# EAGLE design discretefpga (EAGLE 7.7.0)
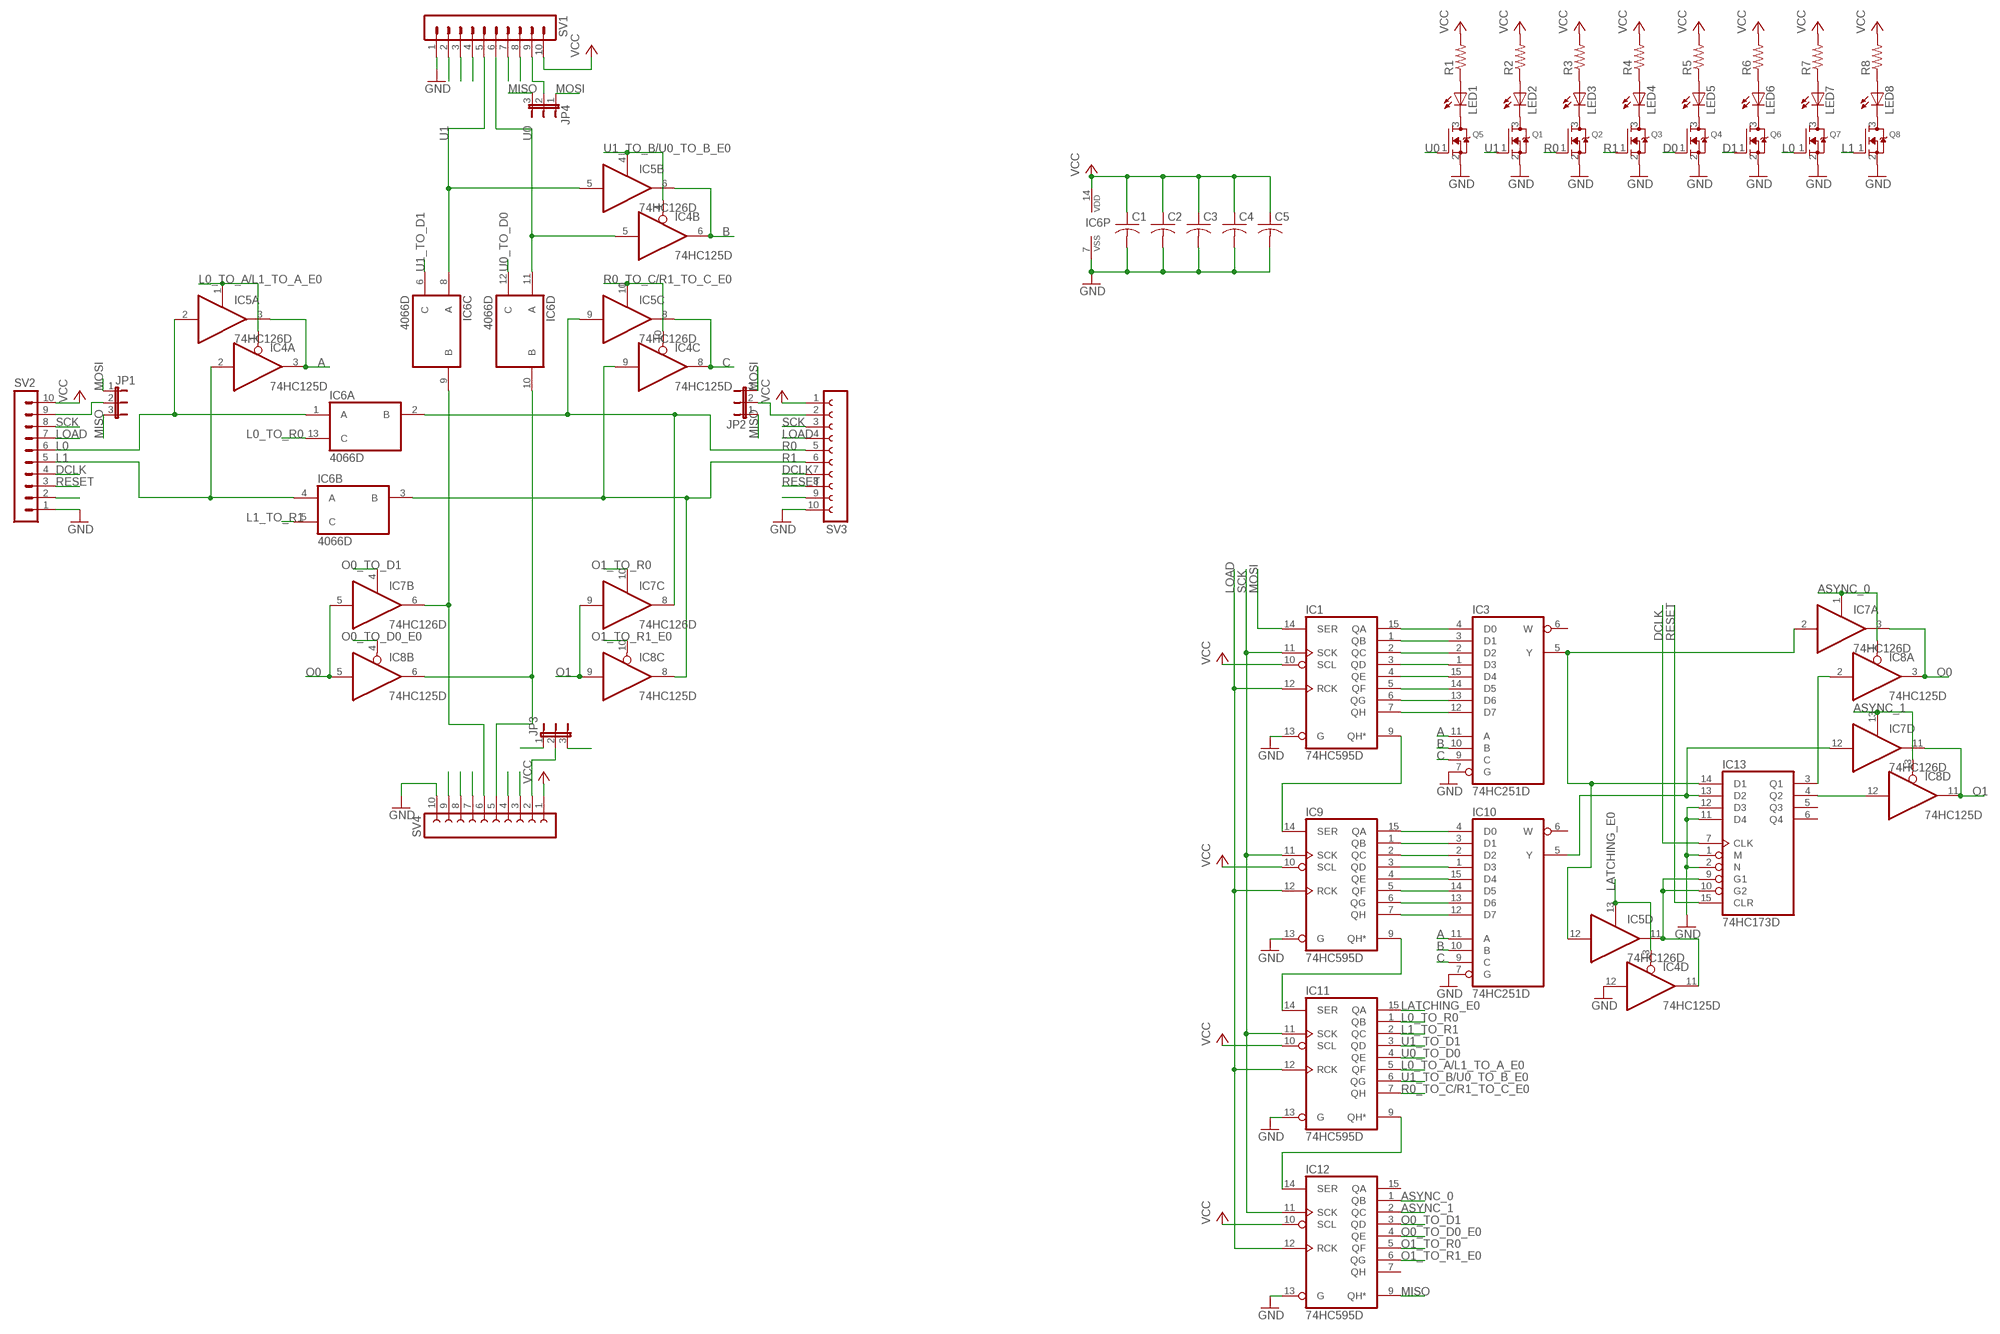
[diagram p0: schematic, sheet 1]

## Parts
C1  C-USC0805  [C0805]
C2  C-USC0805  [C0805]
C3  C-USC0805  [C0805]
C4  C-USC0805  [C0805]
C5  C-USC0805  [C0805]
IC1  74HC595D  [SO16]
IC3  74HC251D  [SO16]
IC4  74HC125D  [SO14]
IC5  74HC126D  [SO14]
IC6  4066D  [SO14]
IC7  74HC126D  [SO14]
IC8  74HC125D  [SO14]
IC9  74HC595D  [SO16]
IC10  74HC251D  [SO16]
IC11  74HC595D  [SO16]
IC12  74HC595D  [SO16]
IC13  74HC173D  [SO16]
JP1  JP2E  [JP2]
JP2  JP2E  [JP2]
JP3  JP2E  [JP2]
JP4  JP2E  [JP2]
LED1  LEDCHIP-LED0805  [CHIP-LED0805]
LED2  LEDCHIP-LED0805  [CHIP-LED0805]
LED3  LEDCHIP-LED0805  [CHIP-LED0805]
LED4  LEDCHIP-LED0805  [CHIP-LED0805]
LED5  LEDCHIP-LED0805  [CHIP-LED0805]
LED6  LEDCHIP-LED0805  [CHIP-LED0805]
LED7  LEDCHIP-LED0805  [CHIP-LED0805]
LED8  LEDCHIP-LED0805  [CHIP-LED0805]
Q1  MOSFET-NREFLOW  [SOT23]
Q2  MOSFET-NREFLOW  [SOT23]
Q3  MOSFET-NREFLOW  [SOT23]
Q4  MOSFET-NREFLOW  [SOT23]
Q5  MOSFET-NREFLOW  [SOT23]
Q6  MOSFET-NREFLOW  [SOT23]
Q7  MOSFET-NREFLOW  [SOT23]
Q8  MOSFET-NREFLOW  [SOT23]
R1  R-US_R0805  [R0805]
R2  R-US_R0805  [R0805]
R3  R-US_R0805  [R0805]
R4  R-US_R0805  [R0805]
R5  R-US_R0805  [R0805]
R6  R-US_R0805  [R0805]
R7  R-US_R0805  [R0805]
R8  R-US_R0805  [R0805]
SV1  MA10-1W  [MA10-1W]
SV2  MA10-1W  [MA10-1W]
SV3  FE10W  [FE10W]
SV4  FE10W  [FE10W]

## Nets
A: IC3.11(A) IC4.3(A:O) IC5.3(A:O) IC10.11(A)
ASYNC_0: IC7.1(A:OE) IC8.1(A:OE) IC12.1(QB)
ASYNC_1: IC7.13(D:OE) IC8.13(D:OE) IC12.2(QC)
B: IC3.10(B) IC4.6(B:O) IC5.6(B:O) IC10.10(B)
C: IC3.9(C) IC4.8(C:O) IC5.8(C:O) IC10.9(C)
D0: IC6.10(D:B) IC8.6(B:O) Q4.1(G) SV4.5
D1: IC6.9(C:B) IC7.6(B:O) Q6.1(G) SV4.6
DCLK: IC13.7(CLK) SV1.4 SV2.4 SV3.7 SV4.7
GND: C1.2 C2.2 C3.2 C4.2 C5.2 IC1.13(G) IC3.7(G) IC4.12(D:I) IC6.7(P:VSS) IC9.13(G) IC10.7(G) IC11.13(G) IC12.13(G) IC13.1(M) IC13.2(N) IC13.11(D4) IC13.12(D3) Q1.2(S) Q2.2(S) Q3.2(S) Q4.2(S) Q5.2(S) Q6.2(S) Q7.2(S) Q8.2(S) SV1.1 SV2.1 SV3.10 SV4.10
L0: IC5.2(A:I) IC6.1(A:A) Q7.1(G) SV2.6
L0_TO_A/L1_TO_A_E0: IC4.1(A:OE) IC5.1(A:OE) IC11.5(QF)
L0_TO_R0: IC6.13(A:C) IC11.1(QB)
L1: IC4.2(A:I) IC6.4(B:A) Q8.1(G) SV2.5
L1_TO_R1: IC6.5(B:C) IC11.2(QC)
LATCHING_E0: IC4.13(D:OE) IC5.13(D:OE) IC11.15(QA)
LOAD: IC1.12(RCK) IC9.12(RCK) IC11.12(RCK) IC12.12(RCK) SV1.7 SV2.7 SV3.4 SV4.4
MISO: IC12.9(QH*) JP1.3 JP2.1 JP3.1 JP4.3
MOSI: IC1.14(SER) JP1.1 JP2.3 JP3.3 JP4.1
N$1: IC1.15(QA) IC3.4(D0)
N$2: IC1.1(QB) IC3.3(D1)
N$3: IC1.2(QC) IC3.2(D2)
N$4: IC1.4(QE) IC3.15(D4)
N$5: IC1.5(QF) IC3.14(D5)
N$6: IC1.6(QG) IC3.13(D6)
N$7: IC1.7(QH) IC3.12(D7)
N$8: IC3.5(Y) IC5.12(D:I) IC7.2(A:I) IC13.14(D1)
N$9: IC9.15(QA) IC10.4(D0)
N$10: IC4.11(D:O) IC5.11(D:O) IC13.9(G1) IC13.10(G2)
N$11: IC9.1(QB) IC10.3(D1)
N$12: IC9.2(QC) IC10.2(D2)
N$13: IC9.4(QE) IC10.15(D4)
N$14: IC9.5(QF) IC10.14(D5)
N$15: IC9.6(QG) IC10.13(D6)
N$16: IC9.7(QH) IC10.12(D7)
N$17: IC7.12(D:I) IC10.5(Y) IC13.13(D2)
N$18: IC1.9(QH*) IC9.14(SER)
N$19: IC8.2(A:I) IC13.3(Q1)
N$20: IC9.9(QH*) IC11.14(SER)
N$21: IC11.9(QH*) IC12.14(SER)
N$22: JP1.2 SV2.9
N$23: JP2.2 SV3.2
N$25: LED1.A R1.1
N$26: LED1.C Q5.3(D)
N$27: SV1.2
N$28: IC8.12(D:I) IC13.4(Q2)
N$29: IC9.3(QD) IC10.1(D3)
N$30: IC1.3(QD) IC3.1(D3)
N$31: SV2.2
N$34: SV3.9
N$38: SV4.9
N$40: LED2.C Q1.3(D)
N$42: LED2.A R2.1
N$43: LED3.A R3.1
N$44: LED4.A R4.1
N$45: LED5.A R5.1
N$46: LED6.A R6.1
N$47: LED7.A R7.1
N$48: LED8.A R8.1
N$49: LED3.C Q2.3(D)
N$50: LED4.C Q3.3(D)
N$51: LED5.C Q4.3(D)
N$52: JP3.2 SV4.2
N$53: LED6.C Q6.3(D)
N$54: JP4.2 SV1.9
N$55: LED7.C Q7.3(D)
N$56: LED8.C Q8.3(D)
O0: IC7.3(A:O) IC7.5(B:I) IC8.3(A:O) IC8.5(B:I)
O0_TO_D0_E0: IC8.4(B:OE) IC12.4(QE)
O0_TO_D1: IC7.4(B:OE) IC12.3(QD)
O1: IC7.9(C:I) IC7.11(D:O) IC8.9(C:I) IC8.11(D:O)
O1_TO_R0: IC7.10(C:OE) IC12.5(QF)
O1_TO_R1_E0: IC8.10(C:OE) IC12.6(QG)
R0: IC5.9(C:I) IC6.2(A:B) IC7.8(C:O) Q2.1(G) SV3.5
R0_TO_C/R1_TO_C_E0: IC4.10(C:OE) IC5.10(C:OE) IC11.7(QH)
R1: IC4.9(C:I) IC6.3(B:B) IC8.8(C:O) Q3.1(G) SV3.6
RESET: IC13.15(CLR) SV1.3 SV2.3 SV3.8 SV4.8
SCK: IC1.11(SCK) IC9.11(SCK) IC11.11(SCK) IC12.11(SCK) SV1.8 SV2.8 SV3.3 SV4.3
U0: IC4.5(B:I) IC6.11(D:A) Q5.1(G) SV1.6
U0_TO_D0: IC6.12(D:C) IC11.4(QE)
U1: IC5.5(B:I) IC6.8(C:A) Q1.1(G) SV1.5
U1_TO_B/U0_TO_B_E0: IC4.4(B:OE) IC5.4(B:OE) IC11.6(QG)
U1_TO_D1: IC6.6(C:C) IC11.3(QD)
VCC: C1.1 C2.1 C3.1 C4.1 C5.1 IC1.10(SCL) IC6.14(P:VDD) IC9.10(SCL) IC11.10(SCL) IC12.10(SCL) R1.2 R2.2 R3.2 R4.2 R5.2 R6.2 R7.2 R8.2 SV1.10 SV2.10 SV3.1 SV4.1
Unconnected: IC3.6(W) IC10.6(W) IC12.7(QH) IC12.15(QA) IC13.5(Q3) IC13.6(Q4)

## Power pins joined to a net without a drawn wire
GND: IC1.8(GND) IC3.8(GND) IC4.7(P:GND) IC5.7(P:GND) IC7.7(P:GND) IC8.7(P:GND) IC9.8(GND) IC10.8(GND) IC11.8(GND) IC12.8(GND) IC13.8(GND)
VCC: IC1.16(VCC) IC3.16(VCC) IC4.14(P:VCC) IC5.14(P:VCC) IC7.14(P:VCC) IC8.14(P:VCC) IC9.16(VCC) IC10.16(VCC) IC11.16(VCC) IC12.16(VCC) IC13.16(VCC)

## Library data of the parts
C1-C5 = resistor:C-US: CAPACITOR, American symbol
IC1 IC9 IC11 IC12 = 74xx-eu:74*595: 8-bit SHIFT REGISTER, output latch
IC3 IC10 = 74xx-eu:74*251: 1 of 8 data SELECTOR/MULTIPLEXER, 3-state
IC4 IC8 = 74xx-eu:74*125: Quad bus BUFFER, 3-state
IC5 IC7 = 74xx-eu:74*126: Quad bus BUFFER, 3-state
IC6 = 40xx:4066: Quad bilateral ANALOG SWITCH
IC13 = 74xx-eu:74*173: 4-bit D type REGISTER, 3-state
JP1-JP4 = jumper:JP2E: JUMPER
LED1-LED8 = led:LED: LED OSRAM: - CHIPLED LG R971, LG N971, LY N971, LG Q971, LY Q971, LO R971, LY R971 LH N974, LH R974 LS Q976, LO Q976, LY Q976 LO Q996 - Hyper CHIPLED LW Q18S LB Q993, LB Q99A, LB R99A - SideLED LS A670, LO A670, LY A670, LG A670, LP A670 LB A673, LV A673, LT A673, LW A673 LH A674 LY A675 LS A676, LA A676, LO A676, LY A676, LW A676 LS A679, LY A679, LG A679 - Hyper Micro SIDELED® LS Y876, LA Y876, LO Y876, LY Y876 LT Y87S - SmartLED LW L88C, LW L88S LB L89C, LB L89S, LG L890 LS L89K, LO L89K, LY L89K LS L896, LA L896, LO L896, LY L896 - TOPLED LS T670, LO T670, LY T670, LG T670, LP T670 LSG T670, LSP T670, LSY T670, LOP T670, LYG T670 LG T671, LOG T671, LSG T671 LB T673, LV T673, LT T673, LW T673 LH T674 LS T676, LA T676, LO T676, LY T676, LB T676, LH T676, LSB T676, LW T676 LB T67C, LV T67C, LT T67C, LS T67K, LO T67K, LY T67K, LW E67C LS E67B, LA E67B, LO E67B, LY E67B, LB E67C, LV E67C, LT E67C LW T67C LS T679, LY T679, LG T679 LS T770, LO T770, LY T770, LG T770, LP T770 LB T773, LV T773, LT T773, LW T773 LH T774 LS E675, LA E675, LY E675, LS T675 LS T776, LA T776, LO T776, LY T776, LB T776 LHGB T686 LT T68C, LB T68C - Hyper Mini TOPLED® LB M676 - Mini TOPLED Santana® LG M470 LS M47K, LO M47K, LY M47K Source: http://www.osram.convergy.de LUXEON: - LUMILED® LXK2-PW12-R00, LXK2-PW12-S00, LXK2-PW14-U00, LXK2-PW14-V00 LXK2-PM12-R00, LXK2-PM12-S00, LXK2-PM14-U00 LXK2-PE12-Q00, LXK2-PE12-R00, LXK2-PE12-S00, LXK2-PE14-T00, LXK2-PE14-U00 LXK2-PB12-K00, LXK2-PB12-L00, LXK2-PB12-M00, LXK2-PB14-N00, LXK2-PB14-P00, LXK2-PB14-Q00 LXK2-PR12-L00, LXK2-PR12-M00, LXK2-PR14-Q00, LXK2-PR14-R00 LXK2-PD12-Q00, LXK2-PD12-R00, LXK2-PD12-S00 LXK2-PH12-R00, LXK2-PH12-S00 LXK2-PL12-P00, LXK2-PL12-Q00, LXK2-PL12-R00 Source: www.luxeon.com KINGBRIGHT: KA-3528ASYC Source: www.kingbright.com
Q1-Q8 = adafruit:MOSFET-N: N-Channel Mosfet 2N7002E - 60V 260mA SOT23 [Digikey: 2N7002ET1GOSTR-ND] - REEL BSH103 - 30V 850mA SOT23 [Digikey: 568-5013-1-ND]
R1-R8 = resistor:R-US_: RESISTOR, American symbol
SV1 SV2 = con-lstb:MA10-1W: PIN HEADER; OC_FARNELL: unknown; OC_NEWARK: unknown
SV3 SV4 = con-lsta:FE10W: FEMALE HEADER; OC_FARNELL: unknown; OC_NEWARK: unknown

## Board
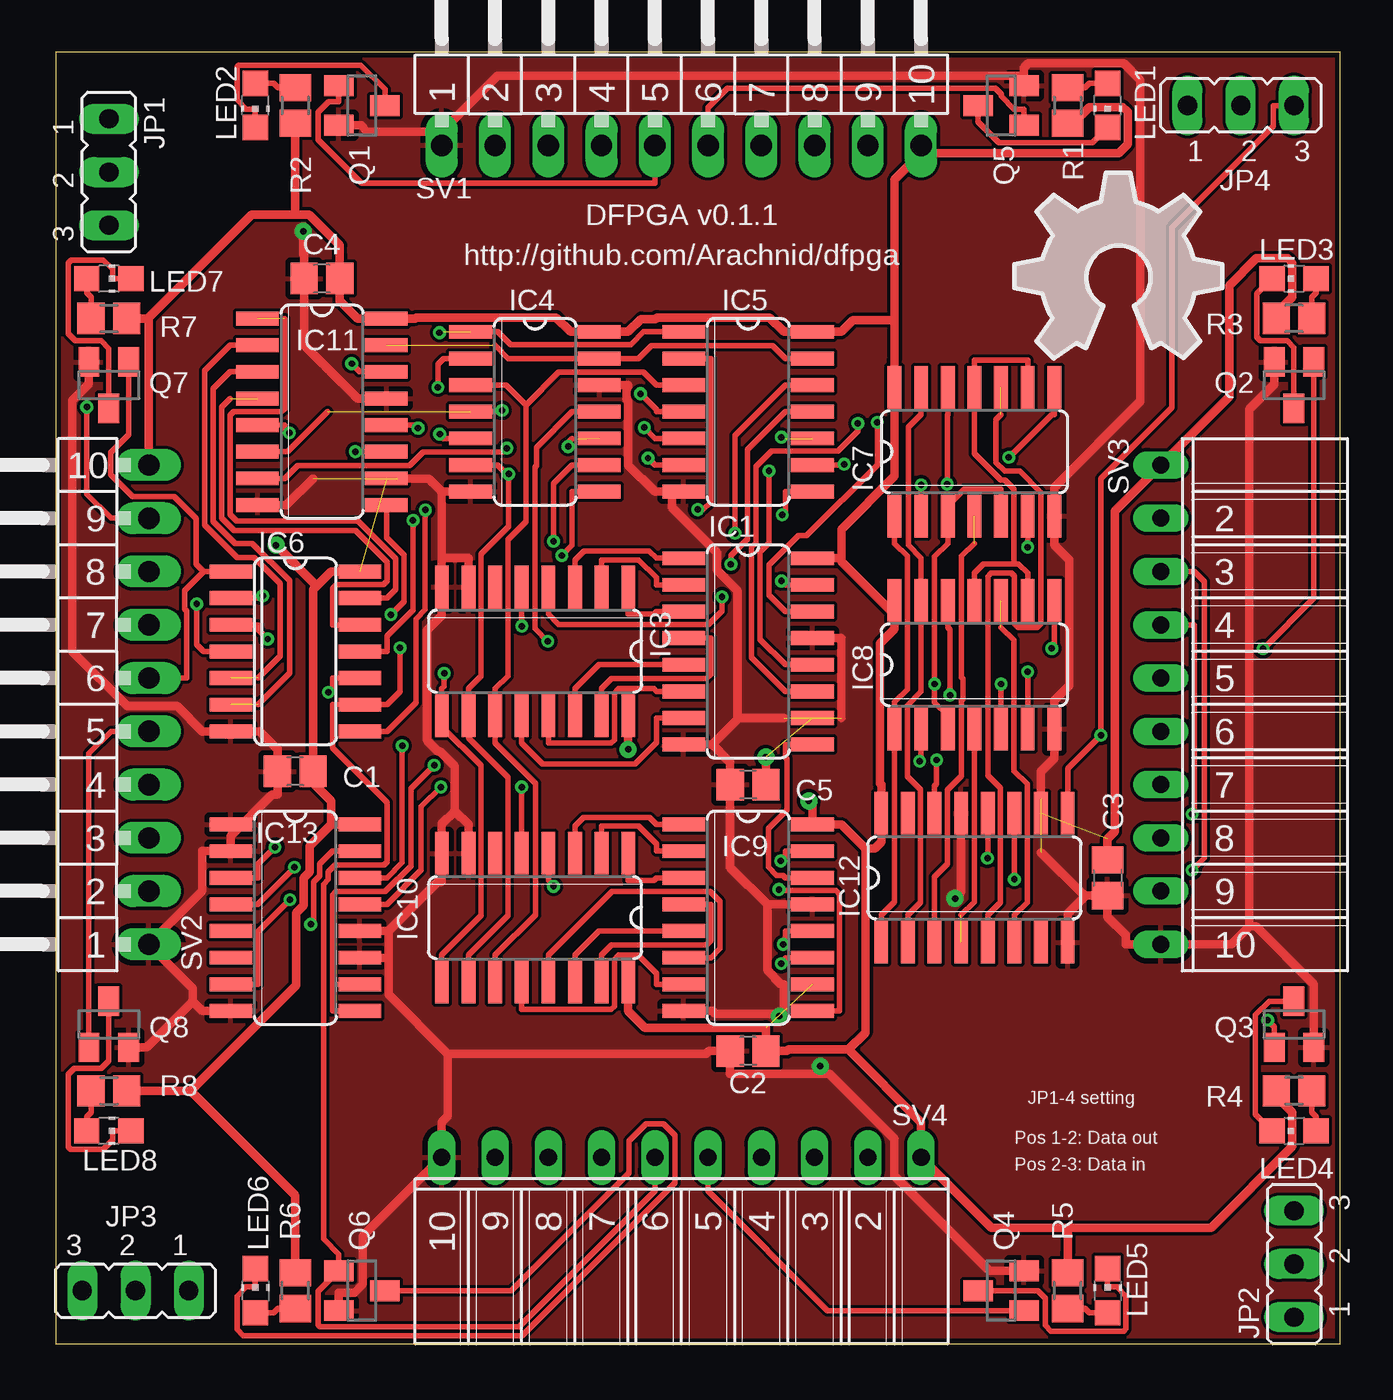
[diagram p1: board, top side]
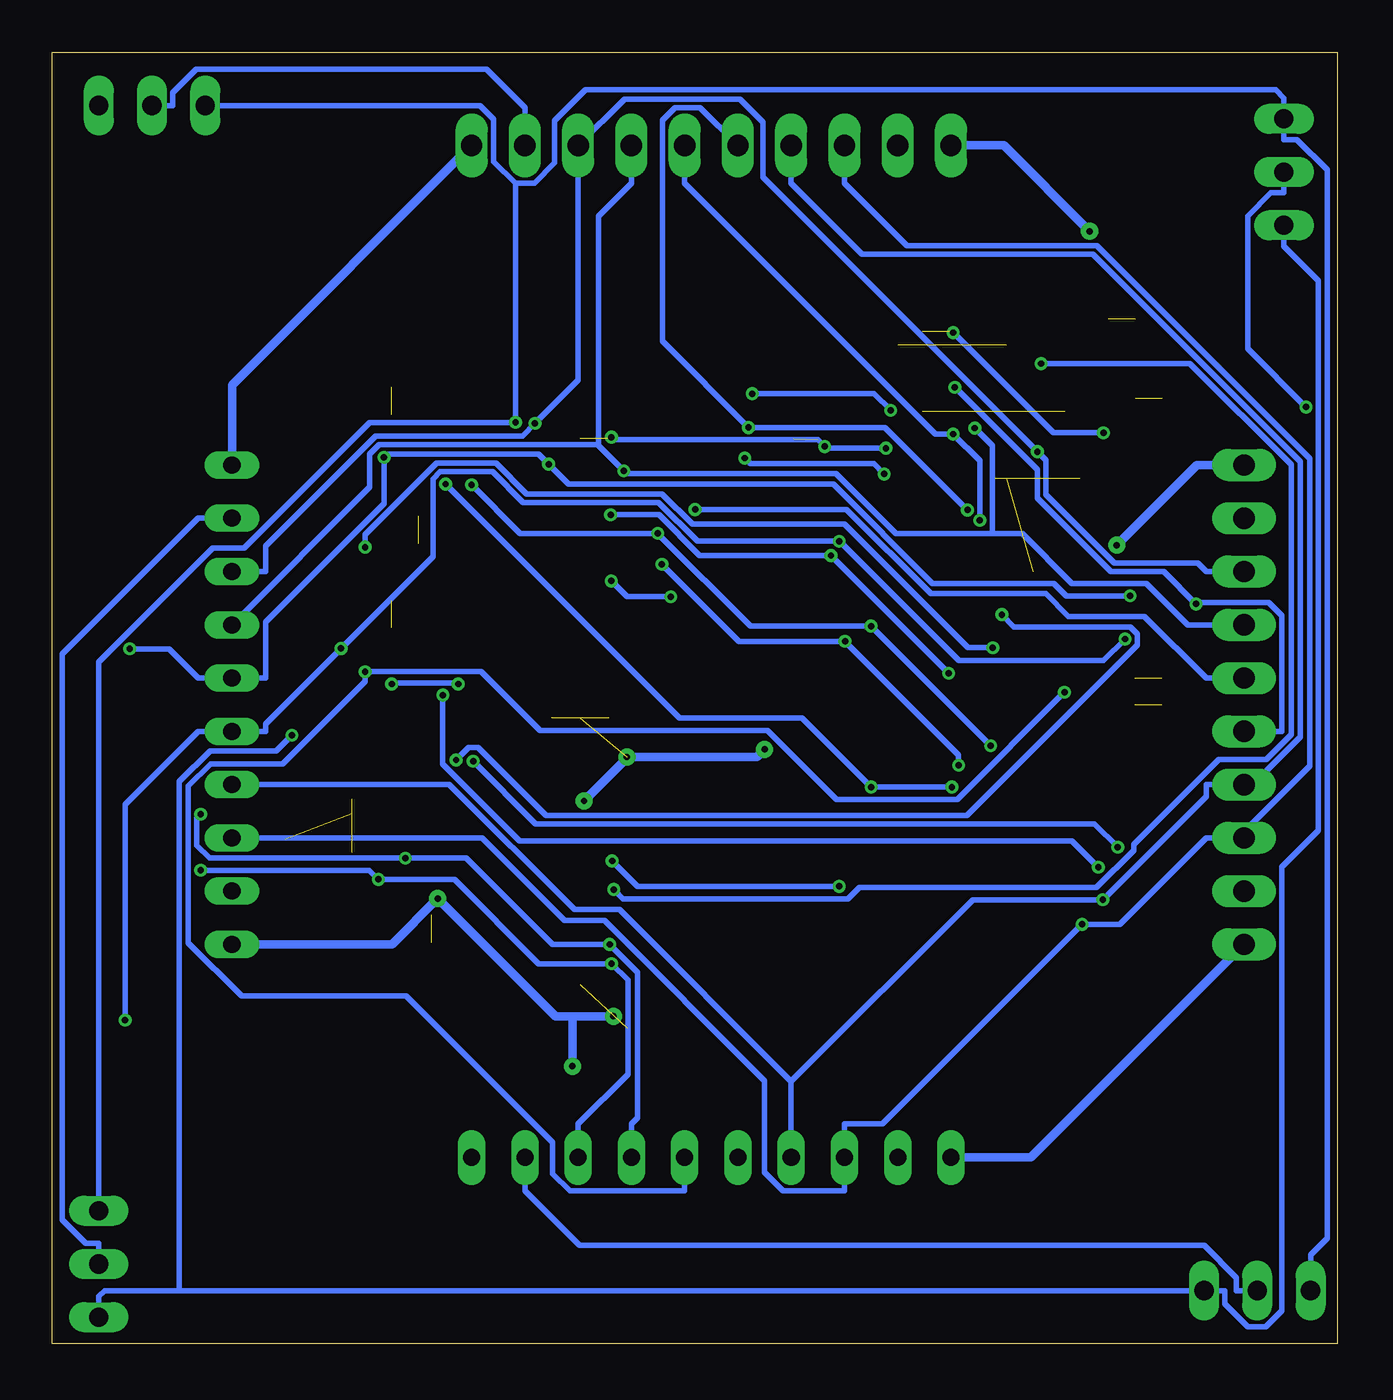
[diagram p2: board, bottom side, seen from below]

Size 61.27 x 61.59 mm. Coordinates in mm from the lower left corner, seen from the top.
Outline: 0,0 61.27,0 61.27,61.59 0,61.59 0,0
Copper layers (1*16): Top 0.035mm / dielectric 1.5mm / Bottom 0.035mm
Design rules "default": minimum track width 6mil, minimum drill 12mil, track to track 6mil, track to pad 6mil, pad to pad 6mil, via to via 6mil, smd to smd 0mil, copper to edge 10mil, drill to drill 10mil, minimum pad ring 10mil, minimum via ring 6mil, stop-mask expansion 2mil, vias tented up to drill 100mil, thermal gap 10mil

### Footprints (pad centres in the part's own frame; a part is rotated, then mirrored left to right if it is on the bottom)
C0805 = smd 1.3 x 1.5: 1 -0.85,0; 2 0.85,0
SO16 = smd 0.66 x 2.032: 1 -4.445,-3.073; 2 -3.175,-3.073; 3 -1.905,-3.073; 4 -0.635,-3.073; 5 0.635,-3.073; 6 1.905,-3.073; 7 3.175,-3.073; 8 4.445,-3.073; 9 4.445,3.073; 10 3.175,3.073; 11 1.905,3.073; 12 0.635,3.073; 13 -0.635,3.073; 14 -1.905,3.073; 15 -3.175,3.073; 16 -4.445,3.073
SO14 = smd 0.66 x 2.032: 1 -3.81,-3.073; 2 -2.54,-3.073; 3 -1.27,-3.073; 4 0,-3.073; 5 1.27,-3.073; 6 2.54,-3.073; 7 3.81,-3.073; 8 3.81,3.073; 9 2.54,3.073; 10 1.27,3.073; 11 0,3.073; 12 -1.27,3.073; 13 -2.54,3.073; 14 -3.81,3.073
JP2 = drill 0.914 long: 1 -2.54,0; 2 0,0; 3 2.54,0
CHIP-LED0805 = smd 1.2 x 1.2: A 0,-1.05; C 0,1.05
SOT23 = smd 1 x 1.4: 1 -0.95,-1.1; 2 0.95,-1.1; 3 0,1.1
R0805 = smd 1.3 x 1.5: 1 -0.85,0; 2 0.85,0
MA10-1W = drill 1.016 long: 1 -11.43,0; 2 -8.89,0; 3 -6.35,0; 4 -3.81,0; 5 -1.27,0; 6 1.27,0; 7 3.81,0; 8 6.35,0; 9 8.89,0; 10 11.43,0
FE10W = drill 0.813 long: 1 -11.43,0; 2 -8.89,0; 3 -6.35,0; 4 -3.81,0; 5 -1.27,0; 6 1.27,0; 7 3.81,0; 8 6.35,0; 9 8.89,0; 10 11.43,0

### Placement (x,y rotation side)
C1  11.43,27.3 180 top
C2  33.02,13.97 180 top
C3  50.16,22.23 270 top
C4  12.7,50.8 180 top
C5  33.02,26.67 180 top
IC1  33.02,33.02 270 top
IC3  22.86,33.02 180 top
IC4  22.86,44.45 270 top
IC5  33.02,44.45 270 top
IC6  11.43,33.02 270 top
IC7  43.81,42.55 0 top
IC8  43.81,32.38 0 top
IC9  33.02,20.32 270 top
IC10  22.86,20.32 180 top
IC11  12.7,44.45 270 top
IC12  43.81,22.23 0 top
IC13  11.43,20.32 270 top
JP1  2.54,55.88 270 top
JP2  59.05,3.81 90 top
JP3  3.81,2.54 180 top
JP4  56.52,59.05 0 top
LED1  50.16,59.05 180 top
LED2  9.53,59.05 180 top
LED3  59.05,50.8 90 top
LED4  59.05,10.16 90 top
LED5  50.16,2.54 0 top
LED6  9.53,2.54 0 top
LED7  2.54,50.8 270 top
LED8  2.54,10.16 270 top
Q1  14.61,59.05 270 top
Q2  59.05,45.72 180 top
Q3  59.05,15.24 0 top
Q4  45.09,2.54 90 top
Q5  45.09,59.05 90 top
Q6  14.61,2.54 270 top
Q7  2.54,45.72 180 top
Q8  2.54,15.24 0 top
R1  48.26,59.05 270 top
R2  11.43,59.05 270 top
R3  59.05,48.9 180 top
R4  59.05,12.06 180 top
R5  48.26,2.54 90 top
R6  11.43,2.54 90 top
R7  2.54,48.9 0 top
R8  2.54,12.06 0 top
SV1  29.84,57.15 0 top
SV2  4.45,30.48 90 top
SV3  52.7,30.48 270 top
SV4  29.84,8.89 180 top
U$1  [OSHW_FILLX350_NOTEXT]  45.72,46.99 0 top

### Tracks (layer width: path | path; a pad name or v marks a point on that pad's centre or on a via)
A
  Top 0.254: IC10.11 20.95,18.54 22.88,20.46 22.88,26.73 20.95,28.65 IC3.11 20.95,31.24 21.57,31.85 21.57,38.35 22.43,39.22 22.43,44.78 | 22.43,44.78 23.98,46.33 28.04,46.33 28.65,45.72 IC5.3 | 22.43,44.78 21.49,45.72 21.08,45.72 IC4.3
ASYNC_0
  Top 0.254: IC12.1 39.37,20.45 40.01,21.08 40.01,28.02 IC8.1 40.01,30.61 40.62,31.22 40.62,37.57 40.01,38.18 IC7.1
ASYNC_1
  Top 0.254: IC7.13 41.27,44.32 40.66,43.71 40.66,38.09 41.27,37.48 IC8.13 41.27,31.11 40.62,30.45 40.62,27.07 41.25,26.43 41.25,21.06 40.64,20.45 IC12.2
B  (via drill 0.3 pad 0.61)
  Top 0.254: IC5.6 28.58,41.91 v28.25,42.24 | IC4.6 21.08,41.91 21.51,41.48 v21.61,41.48 21.61,38.97 20.3,37.66 20.3,31.85 19.68,31.24 IC3.10 19.68,28.89 21.57,27.01 21.57,20.42 19.68,18.54 IC10.10
  Bottom 0.254: v21.61,41.48 22.1,41.98 27.99,41.98 v28.25,42.24
C  (via drill 0.3 pad 0.61)
  Top 0.254: v34.65,39.54 34.8,39.69 34.8,40.64 IC5.8 | v18.53,31.98 18.53,31.36 18.41,31.24 IC3.9 18.41,29.45 20.3,27.57 20.3,20.42 18.41,18.54 IC10.9 | v24.14,37.59 24.64,38.09 24.64,40.64 IC4.8
  Bottom 0.254: v34.65,39.54 32.35,39.54 30.4,37.59 v24.14,37.59 v18.53,31.98
D0  (via drill 0.3 pad 0.61)
  Top 0.254: v13.01,31.08 13.21,31.28 13.21,31.75 IC6.10 | SV4.5 31.11,7.29 36.81,1.59 Q4.1 | IC8.6 v46.35,32.05
  Bottom 0.254: v13.01,31.08 18.11,25.97 23.89,25.97 27.16,29.24 38,29.24 40.81,32.05 v46.35,32.05 46.35,31.59 50.28,27.66 53.71,27.66 54.78,26.59 54.78,19.13 52.24,16.59 44.41,16.59 37.41,9.6 37.41,8.12 36.59,7.29 31.11,7.29 SV4.5
D1  (via drill 0.3 pad 0.61)
  Top 0.254: v46.35,37.99 46.35,38.18 IC7.6 | v16.42,33.2 16.42,31.1 15.8,30.48 IC6.9 13.96,30.48 13.21,30.48 13.21,28.42 15.8,25.83 15.8,22.98 15.65,22.84 13.33,22.84 13,22.5 13,22.14 12.78,21.91 12.78,5 13.51,4.27 Q6.1 12.53,2.51 12.53,0.91 12.62,0.81 22.1,0.81 28.57,7.29 SV4.6
  Bottom 0.254: v46.35,37.99 46.35,38.58 42.95,41.99 40.11,41.99 38.64,40.53 32.19,40.53 30.75,39.09 23.5,39.09 17.61,33.2 v16.42,33.2
DCLK  (via drill 0.3 pad 0.61)
  Top 0.254: IC13.7 9.65,17.14 9.65,19.66 v11.17,21.18
  Bottom 0.254: 26.04,12.52 34.22,20.71 36.38,20.71 42.34,26.67 51.1,26.67 SV3.7 | 26.04,12.52 17.37,21.18 v11.17,21.18 6.25,26.1 6.25,26.67 SV2.4 4.01,26.67 1.75,28.93 1.75,42.08 11.64,51.97 22.65,51.97 26.04,55.35 SV1.4 | 26.04,12.52 26.04,10.49 SV4.7
GND  (via drill 0.3 pad 0.81)  (3 unrouted)
  Top 0.406: 18.41,37.47 | 18.41,37.47 18.41,40.64 | Q7.2 1.59,45.76 0.8,44.98 0.8,33.03 3.42,30.41 5.79,30.41 6.99,29.21 IC6.7 9.04,29.21 9.73,29.21 10.53,28.41 10.58,28.41 C1.2 10.58,26.2 10.34,26.2 8.9,24.77 | 33.94,20.95 33.94,17.81 34.6,17.14 34.72,17.14 34.72,15.94 34.51,15.73 | 18.41,57.8 14.86,57.8 14.56,58.1 Q1.2 | 46.19,60.47 21.08,60.47 18.41,57.8 | 18.41,57.8 SV1.1 | v11.81,53.06 11.81,51.95 11.85,51.91 C4.2 11.85,49.69 11.85,47.64 14.4,45.09 IC11.13 | 46.19,60.47 46.19,60.86 46.38,61.06 50.94,61.06 51.73,60.27 51.73,44.95 47.62,40.84 IC7.7 47.62,38.1 48.35,37.38 48.35,31.41 47.62,30.68 IC8.7 47.62,27.94 46.99,27.3 46.99,26.67 46.99,25.98 | Q5.2 46.19,60.47 | IC11.8 11,40.01 12.27,41.27 | v42.89,21.24 43.18,21.53 IC12.13 | 33.94,20.95 34.72,20.95 IC9.13 | 33.94,20.95 32.17,22.72 C5.2 32.17,27.78 32.12,27.78 31.32,28.57 | 34.51,15.73 31.47,15.73 31.32,15.88 IC9.8 | 34.51,15.73 v34.51,15.62 | 16.32,41.27 17.14,41.27 17.78,41.27 18.41,40.64 | 8.9,24.77 8.36,24.22 IC13.2 6.99,23.5 6.99,21.59 SV2.1 6.53,16.96 6.53,16.33 | IC13.1 8.9,24.77 | 18.7,13.83 31.02,13.83 31.16,13.97 C2.2 32.17,12.86 36.47,12.86 | 36.47,12.86 v36.47,13.24 | 36.47,12.86 36.91,12.86 40.01,9.77 40.01,8.02 44.54,3.49 Q4.2 | 56.92,19.9 57.25,19.9 60.01,17.15 Q3.2 | 56.92,19.9 56.92,44.58 58.1,45.76 Q2.2 | 56.92,19.9 56.06,19.05 SV3.10 51.03,19.05 51.03,19.51 50.16,20.37 C3.2 49.06,21.38 | 18.7,13.83 18.7,10.85 18.41,10.57 SV4.10 14.65,5.12 14.65,2.84 14.25,2.45 13.51,2.45 Q6.2 | 15.88,18.41 15.88,16.66 18.7,13.83 | 19.03,25.4 18.41,24.78 18.41,24.77 IC10.8 18.41,22.02 18.21,22.02 15.88,19.68 | 19.03,25.4 19.05,25.4 19.68,24.77 IC10.7
  Top 0.406: 19.03,25.4 19.03,27.55 18.33,28.25 18.25,28.25 17.73,28.77 17.73,34.03 18.41,34.72 IC3.8 18.41,37.47 | 15.88,19.68 15.73,19.68 IC13.12 | 15.88,19.68 15.88,18.41 | IC13.11 15.88,18.41 | 32.52,29.84 32.52,29.78 31.32,28.57 | 29.4,40.64 29.4,39.88 31.54,37.74 31.54,36.9 32.52,35.92 32.52,29.84 | 32.52,29.84 34.72,29.84 | IC1.8 31.32,28.57 | 6.53,16.33 6.99,15.88 IC13.8 | 6.53,16.33 4.35,14.14 Q8.2 | 49.06,21.38 46.99,23.44 | 49.06,21.38 49.06,21.32 48.26,20.52 IC12.8 | 18.41,37.47 19.68,37.47 IC3.7 | IC4.7 18.41,40.64 | 29.4,40.64 28.57,40.64 27.3,41.91 27.3,44.96 27.23,45.04 27.23,45.59 27.3,45.66 27.3,45.72 IC4.12 | IC5.7 29.4,40.64 | IC1.13 37.47,33.66 37.47,29.84
  Bottom 0.406: SV1.1 15.9,57.15 v11.81,53.06 | 36.47,15.62 37.27,15.62 v42.89,21.24 45.07,19.05 51.03,19.05 SV3.10 | 36.47,15.62 v34.51,15.62 | 36.47,15.62 v36.47,13.24 | SV4.10 14.61,8.89 SV2.1
  pour Top: 0,0 0,62.23 60.96,62.23 60.96,0
L0  (via drill 0.3 pad 0.61)
  Top 0.254: Q7.1 3.49,43.36 2.62,42.5 2.62,41.46 3.67,40.41 5.64,40.41 6.71,39.35 6.71,37.19 7.06,36.83 | 7.06,36.83 6.14,35.91 6.14,35.05 6.25,34.94 6.25,31.75 SV2.6 | IC6.1 7.06,36.83 | v30.62,39.79 30.88,39.79 31.24,40.15 31.24,46.99 IC5.2
  Bottom 0.254: v30.62,39.79 23.4,39.79 19.38,35.77 13.9,35.77 12.82,34.69 9.19,34.69 6.25,31.75 SV2.6
L0_TO_A/L1_TO_A_E0  (via drill 0.3 pad 0.61)  (1 unrouted)
  Top 0.254: IC4.1 21.08,48.26 21.69,47.65 27.43,47.65 28.04,48.26 IC5.1 | v18.31,48.22 18.45,48.22 18.49,48.26 | IC11.5 10.92,43.81 10.92,43.67 v11.15,43.45
  Bottom 0.254: v11.15,43.45 13.53,43.45 v18.31,48.22
L0_TO_R0  (1 unrouted)
  Top 0.254: 10.92,48.9 10.92,44.59 10.79,44.45 8.48,44.45 8.33,44.3 8.33,39.55 8.63,39.24 14.42,39.24 16.2,37.45 16.2,35.97 15.8,35.56 IC6.13
L1  (via drill 0.3 pad 0.61)
  Top 0.254: SV2.5 2.64,29.21 1.59,28.16 Q8.1 | v18.23,45.62 18.23,46.73 18.49,46.99 IC4.2 | IC6.4 7.06,33.02 6.73,33.35 v6.73,35.29
  Bottom 0.254: v18.23,45.62 14.3,41.68 14.3,40.33 10.8,36.83 8.27,36.83 v6.73,35.29 6.67,35.34 3.26,35.34 2.64,34.73 2.64,29.21 SV2.5
L1_TO_R1  (1 unrouted)
  Top 0.254: 9.65,31.75 10.71,32.81 10.71,36.26 9.48,37.49 8.66,37.49 7.11,39.04 7.11,46.41 8.33,47.62 IC11.2
LATCHING_E0  (1 unrouted)
  Top 0.254: 20.95,47.62 21.58,46.99 IC4.13 27.23,46.99 27.8,46.99 28.41,47.6 34.19,47.6 34.8,46.99 IC5.13
LOAD  (via drill 0.3 pad 0.61)
  Top 0.254: v17.28,43.67 17.21,43.67 17.07,43.81 IC11.12 | IC12.12 44.45,23.17 v44.44,23.16 | v34.69,19.05 34.8,19.15 34.8,19.68 IC9.12 | SV3.4 54.3,34.29 54.3,25.36 v54.2,25.25 | IC1.12 34.8,32.38 33.59,33.6 33.59,37.75 34.02,38.18 v34.02,41.63
  Bottom 0.254: 16.44,38.64 21.03,38.64 23.91,41.51 33.9,41.51 v34.02,41.63 35.22,42.83 35.22,42.88 | 16.44,38.64 15.02,38.64 12.65,36.27 9.11,36.27 7.13,34.29 6.25,34.29 SV2.7 | 16.44,38.64 16.44,42.83 v17.28,43.67 | 35.22,42.88 35.22,53.78 33.66,55.35 SV1.7 | 35.22,42.88 45.69,42.88 46.14,42.44 46.14,40.85 SV3.4 | SV4.4 33.66,10.49 33.35,10.79 33.35,17.71 v34.69,19.05 37.42,19.05 41.53,23.16 v44.44,23.16 53.76,23.16 54.38,23.78 54.38,25.07 v54.2,25.25
MISO  (via drill 0.3 pad 0.61)
  Top 0.254: IC12.9 48.26,26.59 48.26,27.43 v49.85,29.02 49.85,41.26 53.24,44.65 53.24,53.24 58.06,58.06 58.06,59.05 JP4.3
  Bottom 0.254: 55.22,2.54 JP3.1 5.36,2.54 5.36,1.92 4.26,0.82 3.39,0.82 2.64,1.57 2.64,22.74 0.9,24.49 0.9,50.71 2.54,52.35 JP1.3 | 55.22,2.54 58.78,2.54 59.05,2.26 JP2.1 | v49.85,29.02 50.6,28.27 53.75,28.27 55.22,26.81 55.22,2.54
MOSI  (via drill 0.3 pad 0.61)
  Top 0.254: IC1.14 34.8,34.92 34.01,35.71 34.01,37.13 35.42,38.54 35.81,38.54 39.18,41.91 v39.18,43.94
  Bottom 0.254: JP2.3 59.05,32.52 53.62,37.96 52.13,37.96 46.15,43.94 v39.18,43.94 39.18,55.34 | 39.18,55.34 40.22,56.38 40.22,58.4 40.88,59.05 JP4.1 | 39.18,55.34 38.28,55.34 37.31,56.32 37.31,58.33 35.84,59.8 2.93,59.8 2.54,59.41 JP1.1 2.54,57.43 1.92,57.43 0.48,55.99 0.48,5.03 1.27,4.24 JP3.3
N$1  (via drill 0.3 pad 0.61)
  Top 0.254: v34.61,36.38 34.8,36.2 IC1.15 | IC3.4 23.5,34.8 23.98,34.31 31.14,34.31 31.78,34.95 v31.78,35.63
  Bottom 0.254: v31.78,35.63 33.86,35.63 v34.61,36.38
N$2
  Top 0.254: IC1.1 28.65,37.47 28.3,37.82 25.19,37.82 24.77,37.39 IC3.3
N$3
  Top 0.254: IC1.2 28.65,36.2 28.65,36.54 27.8,37.39 26.04,37.39 IC3.2
N$4
  Top 0.254: IC1.4 31.24,33.66 31.24,31.93 31.04,31.73 26.52,31.73 26.04,31.24 IC3.15
N$5
  Top 0.254: IC3.14 24.77,31.24 25.91,32.38 IC1.5
N$6
  Top 0.254: IC1.6 28.65,31.11 28.52,31.24 26.85,31.24 26.64,31.04 26.64,28.81 26.49,28.65 23.5,28.65 IC3.13
N$7
  Top 0.254: IC1.7 28.65,29.84 28.65,28.68 27.63,27.66 23.21,27.66 22.23,28.65 IC3.12
N$8  (via drill 0.3 pad 0.61)
  Top 0.254: v32.4,38.65 32.4,43.32 34.8,45.72 IC5.12 | v16.53,28.53 16.53,22.95 15.8,22.23 IC13.14 | v22.23,34.23 IC3.5 | v41.27,40.97 41.27,40.77 IC7.2
  Bottom 0.254: v41.27,40.97 38.96,38.65 v32.4,38.65 27.98,34.23 v22.23,34.23 v16.53,28.53
N$9  (via drill 0.3 pad 0.61)
  Top 0.254: v34.58,23.03 34.8,23.25 34.8,23.5 IC9.15 | v23.74,21.82 23.74,21.85 23.5,22.1 IC10.4
  Bottom 0.254: v23.74,21.82 33.37,21.82 v34.58,23.03
N$10  (via drill 0.3 pad 0.61)
  Top 0.254: v23.47,33.5 22.86,34.11 22.86,41.81 22.93,41.88 22.93,42.75 24.64,44.45 IC4.11 | v32.2,37.17 32.2,37.58 32.99,38.37 32.99,42.64 34.8,44.45 IC5.11 | 13.21,17.14 13.21,21.42 13.36,21.57 15.71,21.57 16.94,22.79 16.94,26.48 v18.05,27.59 | 13.21,17.14 13.21,15.88 IC13.9 | 13.21,17.14 13.86,17.14 IC13.10
  Bottom 0.254: v18.05,27.59 18.05,28.09 v23.47,33.5 28.53,33.5 v32.2,37.17
N$11
  Top 0.254: IC9.1 28.65,24.77 28.31,25.1 25.18,25.1 24.77,24.69 IC10.3
N$12
  Top 0.254: IC9.2 28.65,23.5 28.65,23.84 27.8,24.69 26.04,24.69 IC10.2
N$13
  Top 0.254: IC9.4 31.24,20.95 31.24,19.23 31.04,19.02 26.52,19.02 26.04,18.54 IC10.15
N$14
  Top 0.254: IC10.14 24.77,18.54 25.91,19.68 IC9.5
N$15
  Top 0.254: IC9.6 31.24,18.41 31.68,18.85 31.68,21.11 31.2,21.58 26.54,21.58 23.5,18.54 IC10.13
N$16
  Top 0.254: IC9.7 28.65,17.14 28.65,17.67 27.78,18.54 26.85,18.54 26.64,18.34 26.64,16.1 26.5,15.95 22.23,15.95 IC10.12
N$17  (via drill 0.3 pad 0.61)
  Top 0.254: v18.37,26.55 17.43,25.62 17.43,22.59 15.8,20.95 IC13.13 | IC10.5 v22.23,26.55 | IC7.12 42.55,44.32 42.52,44.29 v42.52,41
  Bottom 0.254: v42.52,41 31.37,29.85 25.52,29.85 v22.23,26.55 v18.37,26.55
N$18
  Top 0.254: IC1.9 34.8,28.57 34.8,27.96 34.88,27.88 34.88,25.45 33.99,24.57 33.99,22.73 34.38,22.35 34.68,22.35 34.8,22.23 IC9.14
N$19  (via drill 0.3 pad 0.61)
  Top 0.254: v10.46,23.69 9.65,22.88 9.65,22.23 IC13.3 | IC8.2 41.27,28.02 41.2,27.94 v41.2,27.79
  Bottom 0.254: v10.46,23.69 11.57,24.8 38.22,24.8 v41.2,27.79
N$20  (via drill 0.3 pad 0.61)
  Top 0.254: IC11.14 14.48,46.35 14.48,46.39 v14.12,46.75 | v34.49,21.66 34.55,21.61 37.21,21.61 37.39,21.44 37.39,15.88 IC9.9
  Bottom 0.254: v34.49,21.66 34.05,21.22 23.33,21.22 22.78,21.77 11.48,21.77 9.71,23.54 9.71,23.81 5.65,27.87 3.39,27.87 2.2,29.06 2.2,41.92 7.02,46.75 v14.12,46.75
N$21  (via drill 0.3 pad 0.61)
  Top 0.254: v15.99,34.77 16.61,35.4 16.61,37.62 15.77,38.46 IC11.9 | IC12.14 41.91,26.59 42.01,26.7 v42.01,27.84
  Bottom 0.254: v15.99,34.77 15.41,34.2 9.87,34.2 9.53,33.85 9.53,33.33 17.65,25.21 37.73,25.21 40.96,28.44 41.42,28.44 v42.01,27.84
N$22  (via drill 0.3 pad 0.61)
  Top 0.254: SV2.9 2.64,39.37 1.49,40.52 v1.49,44.68
  Bottom 0.254: JP1.2 2.54,54.89 3.16,54.89 4.26,53.78 4.26,47.45 v1.49,44.68
N$23
  Bottom 0.254: JP2.2 59.05,4.8 59.67,4.8 60.79,5.92 60.79,32.89 54.3,39.37 SV3.2
N$25
  Top 0.254: LED1.A 49.28,60.1 49.09,59.91 R1.1
N$26
  Top 0.254: Q5.3 43.98,58.28 44.98,57.27 49.44,57.27 LED1.C
N$28  (via drill 0.3 pad 0.61)
  Top 0.254: IC13.4 9.65,20.95 9.65,20.99 v11.39,22.73 | IC8.12 42.55,34.16 42.65,34.06 v42.65,30.94
  Bottom 0.254: v11.39,22.73 12.65,23.99 38.99,23.99 42.65,27.65 v42.65,30.94
N$29
  Top 0.254: IC9.3 28.65,22.23 28.52,22.1 27.3,22.1 IC10.1
N$30
  Top 0.254: IC1.3 28.65,34.92 28.52,34.8 27.3,34.8 IC3.1
N$40
  Top 0.254: LED2.C 9.53,58.88 9.09,58.88 8.65,59.32 8.65,60.89 8.74,60.98 14.55,60.98 15.71,59.83 Q1.3
N$42
  Top 0.254: LED2.A 10.4,60.1 10.6,59.91 R2.1
N$43
  Top 0.254: R3.1 59.91,49.92 60.1,50.12 LED3.A
N$44
  Top 0.254: R4.1 59.91,11.04 60.1,10.84 LED4.A
N$45
  Top 0.254: LED5.A 49.28,1.49 49.09,1.69 R5.1
N$46
  Top 0.254: LED6.A 10.4,1.49 10.6,1.69 R6.1
N$47
  Top 0.254: R7.1 1.69,49.92 1.49,50.12 LED7.A
N$48
  Top 0.254: R8.1 1.69,11.04 1.49,10.84 LED8.A
N$49
  Top 0.254: Q2.3 59.05,47.52 58.74,47.83 57.46,47.83 57.27,48.02 57.27,50.07 LED3.C
N$50
  Top 0.254: Q3.3 57.88,16.34 57.22,15.68 57.22,10.95 LED4.C
N$51
  Top 0.254: LED5.C 50.16,2.71 50.6,2.71 51.04,2.27 51.04,0.72 50.94,0.61 47.47,0.61 47.2,0.88 47.2,2.17 46.83,2.54 Q4.3
N$52
  Bottom 0.254: JP3.2 4.8,2.54 4.8,3.16 6.33,4.69 36.14,4.69 38.73,7.29 SV4.2
N$53
  Top 0.254: LED6.C 9.53,2.71 9.09,2.71 8.65,2.27 8.65,0.69 8.95,0.39 22.25,0.39 29.54,7.67 29.54,9.94 28.99,10.49 28.15,10.49 27.34,9.67 27.34,8.16 21.72,2.54 Q6.3
N$54
  Bottom 0.254: JP4.2 55.52,59.05 55.52,59.67 54.42,60.78 40.56,60.78 38.73,58.95 SV1.9
N$55
  Top 0.254: LED7.C 2.71,50.8 2.71,51.24 2.27,51.68 0.75,51.68 0.6,51.53 0.6,48.17 0.94,47.83 2.17,47.83 2.54,47.47 Q7.3
N$56
  Top 0.254: LED8.C 2.71,10.16 2.71,9.72 2.27,9.28 0.72,9.28 0.61,9.39 0.61,12.86 0.88,13.13 2.17,13.13 2.54,13.49 Q8.3
O0  (via drill 0.3 pad 0.61)
  Top 0.254: IC7.5 45.09,40.77 43.35,40.77 42.55,39.97 IC7.3 42.55,38.18 41.91,37.55 v41.91,31.47 41.91,30.59 42.55,29.96 IC8.3 | IC8.5 v45.09,31.47
  Bottom 0.254: v45.09,31.47 45.03,31.52 41.97,31.52 v41.91,31.47
O0_TO_D0_E0  (1 unrouted)
  Top 0.254: 43.18,20.45 43.81,21.08 43.81,28.02 IC8.4
O0_TO_D1  (1 unrouted)
  Top 0.254: 43.81,38.18 43.2,37.57 43.2,31.78 43.26,31.73 43.26,30.72 43.2,30.67 43.2,27.09 42.52,26.41 42.52,22.89 41.91,22.28 41.91,20.45 IC12.3
O1
  Top 0.254: IC7.9 46.35,46.91 43.81,46.91 IC7.11 43.81,42.46 45.07,41.2 45.27,41.2 45.7,40.77 45.7,37.19 | 45.7,37.19 45.92,37.19 46.35,36.75 IC8.9 | 45.7,37.19 44.25,37.19 43.81,36.75 IC8.11
O1_TO_R0  (1 unrouted)
  Top 0.254: 45.09,44.32 44.84,44.08 44.84,42.03 45.27,41.61 45.97,41.61 46.99,40.6 46.99,34.34 46.8,34.16 45.9,34.16 45.72,34.34 45.72,36.62 45.58,36.75 44.61,36.75 44.45,36.59 44.45,27.11 45.06,26.5 45.06,21.06 44.45,20.45 IC12.5
O1_TO_R1_E0  (1 unrouted)
  Top 0.254: IC12.6 45.72,20.45 46.33,21.06 46.33,26.7 45.7,27.33 45.7,33.55 45.09,34.16
R0  (via drill 0.3 pad 0.61)
  Top 0.254: v9.88,35.67 9.76,35.67 9.65,35.56 IC6.2 | IC7.8 47.62,44.32 47.5,44.32 v45.45,42.28 | v57.58,33.14 60.01,35.57 Q2.1 | v37.6,41.95 37.43,41.95 37.39,41.91 IC5.9
  Bottom 0.254: v9.88,35.67 12.91,35.67 13.51,36.27 19.3,36.27 24.03,40.99 36.65,40.99 v37.6,41.95 38.08,42.42 45.31,42.42 v45.45,42.28 45.45,40.08 51.1,34.43 51.1,31.75 SV3.5 52.89,31.75 54.3,31.75 55.7,33.14 v57.58,33.14
R0_TO_C/R1_TO_C_E0  (via drill 0.3 pad 0.61)  (2 unrouted)
  Top 0.254: IC11.7 10.92,41.27 11.53,41.88 16.88,41.88 17.52,42.52 21.33,42.52 v21.52,42.71 | 24.64,43.18 24.44,42.98 v24.44,42.79 | v34.61,43.24 34.74,43.24 34.8,43.18
  Bottom 0.254: v21.52,42.71 24.36,42.71 v24.44,42.79 24.76,43.11 34.48,43.11 v34.61,43.24
R1  (via drill 0.3 pad 0.61)
  Top 0.254: v10.11,33.61 9.65,34.07 9.65,34.29 IC6.3 | Q3.1 58.1,15.12 57.8,15.42 v57.8,15.44 | IC8.8 47.62,33.29 v47.5,33.16 | v23.74,38.27 23.74,41.02 24.64,41.91 IC4.9
  Bottom 0.254: v23.74,38.27 30.51,38.27 32.36,40.12 38.81,40.12 40.27,41.59 42.77,41.59 43.12,41.24 43.12,37.55 v47.5,33.16 51.1,29.56 51.1,29.21 SV3.6 54.3,29.21 57.8,25.71 v57.8,15.44 | v23.74,38.27 | v23.74,38.27 18.05,32.58 11.14,32.58 v10.11,33.61
RESET  (via drill 0.3 pad 0.61)
  Top 0.254: v12.16,20.01 12.31,20.16 12.31,22.02 12.6,22.31 12.6,22.88 13.21,23.5 IC13.15
  Bottom 0.254: 4.74,24.13 1.31,27.56 1.31,42.23 11.46,52.37 20.52,52.37 23.5,55.35 SV1.3 | SV3.8 51.1,24.13 40.77,24.13 36.84,20.2 34.95,20.2 27.3,12.55 27.3,8.17 26.43,7.29 23.5,7.29 SV4.8 23.5,10.49 21.68,10.49 v12.16,20.01 10.37,20.01 6.25,24.13 4.74,24.13 | SV2.3 4.74,24.13
SCK  (via drill 0.3 pad 0.61)
  Top 0.254: v14.3,42.55 14.48,42.55 IC11.11 | v34.6,18.13 34.8,18.32 34.8,18.41 IC9.11 | v38.26,43.9 38.26,43.52 37.3,42.57 34.13,42.57 33.39,41.83 33.39,38.2 33.18,37.99 33.18,32.73 34.8,31.11 IC1.11 | SV3.3 54.3,36.83 54.79,36.35 54.79,23.18 v54.2,22.58 | IC12.11 v45.72,22.15
  Bottom 0.254: SV2.8 6.25,36.83 6.66,37.24 10.63,37.24 13.89,40.49 13.89,42.14 v14.3,42.55 27.38,55.62 27.38,58.26 28.48,59.36 33.98,59.36 SV1.8 36.2,45.96 v38.26,43.9 38.86,43.3 45.86,43.3 51.1,38.05 51.1,36.83 SV3.3 | SV4.3 36.2,10.49 33.83,12.86 33.83,17.35 v34.6,18.13 38.07,18.13 42.09,22.15 v45.72,22.15 46.15,22.58 v54.2,22.58
U0  (via drill 0.3 pad 0.61)
  Top 0.254: v17.04,39.27 17.04,35 15.8,33.76 15.8,33.02 IC6.11 | v18.31,43.38 18.31,43.36 18.49,43.18 IC4.5 | Q5.1 46.19,58.88 45.7,58.88 45.09,59.5 45.09,59.59 44.82,59.87 32.03,59.87 31.11,58.95 SV1.6
  Bottom 0.254: v17.04,39.27 17.04,42.11 v18.31,43.38 19.15,43.38 31.11,55.35 SV1.6
U0_TO_D0  (1 unrouted)
  Top 0.254: IC6.12 13.21,34.29 13.21,36.02 13.41,36.22 15.63,36.22 15.8,36.38 15.8,37.28 14.3,38.78 8.52,38.78 7.92,39.38 7.92,44.68 8.33,45.09
U1  (via drill 0.3 pad 0.61)
  Top 0.254: v17.63,39.77 17.63,35.02 17.18,34.57 17.18,30.59 15.8,29.21 IC6.8 | v28.07,43.7 28.59,43.18 IC5.5 | Q1.1 13.51,59.23 13.02,59.23 12.53,58.73 12.53,57.42 14.6,55.35 28.57,55.35 SV1.5
  Bottom 0.254: v17.63,39.77 21.56,43.7 v28.07,43.7 32.18,47.81 32.18,58.35 31.58,58.96 30.38,58.96 SV1.5
U1_TO_B/U0_TO_B_E0  (via drill 0.3 pad 0.61)  (1 unrouted)
  Top 0.254: v21.29,44.52 21.15,44.52 21.08,44.45 IC4.4 | IC5.4 28.65,44.45 28.65,44.55 v27.89,45.31 | 12.98,44.45 11.07,42.55 10.92,42.55 IC11.6
  Bottom 0.254: v27.89,45.31 22.08,45.31 v21.29,44.52
U1_TO_D1  (1 unrouted)
  Top 0.254: 9.65,30.48 11.15,31.98 11.15,36.4 9.37,38.18 8.55,38.18 7.52,39.21 7.52,45.54 8.33,46.35 IC11.3
VCC  (via drill 0.3 pad 0.81)  (4 unrouted)
  Top 0.406: 38.61,23.62 37.47,24.77 IC9.16 36.09,25.71 v35.91,25.89 | 38.61,23.62 39.06,23.62 39.37,23.93 IC12.16 39.37,26.67 39.32,26.72 39.32,33.4 40.01,34.09 40.01,34.77 | 38.61,23.62 38.61,14.83 37.81,14.03 | 37.81,14.03 34.94,14.03 34.88,13.97 C2.1 33.87,15.08 28.1,15.08 27.3,15.88 IC10.16 | 37.81,14.03 41.27,10.57 SV4.1 44.62,5.55 48.26,5.55 | 12.45,36.15 v10.51,38.09 | 12.45,36.15 13.13,36.83 IC6.14 | 12.45,36.15 12.28,35.98 12.28,28.41 C1.1 12.28,26.75 13.13,25.9 13.13,24.77 | 11.43,53.85 12.09,53.85 13.55,52.39 13.55,51.91 C4.1 13.55,50.25 13.55,49.69 13.6,49.69 14.4,48.9 IC11.16 17.14,48.9 17.2,48.95 23.88,48.95 24.56,48.26 IC4.14 27.3,48.26 27.92,48.87 28.6,48.87 28.67,48.95 34.04,48.95 34.72,48.26 IC5.14 37.47,48.26 38.02,48.81 40.01,48.81 | 11.43,53.85 9.35,53.85 4.4,48.9 | 11.43,53.85 R2.2 | SV2.10 4.45,48.85 4.4,48.9 | R7.2 4.4,48.9 | v27.3,28.35 27.3,28.57 IC3.16 | R3.2 58.2,49.15 58.98,49.92 58.98,51.55 58.76,51.77 57.27,51.77 55.97,50.47 55.97,45.17 SV3.1 50.51,39.71 50.51,24.42 50.16,24.08 C3.1 | 40.01,34.77 37.47,37.31 37.47,37.47 | IC8.14 40.01,34.77 | 6.45,12.06 11.48,17.1 11.48,20.55 11.83,20.91 11.83,22.22 12.11,22.51 12.11,23.75 13.13,24.77 | 40.01,48.81 40.01,46.99 IC7.14 40.01,44.25 40.01,41.38 37.47,38.84 37.47,37.47 | 41.27,56.78 40.01,55.52 40.01,48.81 | C5.1 v33.87,27.99 | 6.45,12.06 R8.2 | 6.45,12.06 11.43,7.08 R6.2 | 48.26,5.55 55.1,5.55 58.98,9.43 58.98,11.04 58.2,11.81 R4.2 | 41.27,56.78 50.7,56.78 51.12,57.21 51.12,58.75 50.89,58.98 49.29,58.98 48.52,58.2 R1.2 | SV1.10 41.27,56.78 | IC1.16 37.47,37.47 | 48.26,5.55 48.26,4.33 R5.2 | IC13.16 13.13,24.77
  Bottom 0.406: v35.91,25.89 33.87,27.94 v33.87,27.99 27.67,27.99 v27.3,28.35 | SV2.10 6.69,41.91 v10.51,38.09 | SV1.10 52.7,45.72 SV3.1

### Text on the board
tNames: DFPGA v0.1.1 | http://github.com/Arachnid/dfpga | JP1-4 setting | Pos 1-2: Data out | Pos 2-3: Data in